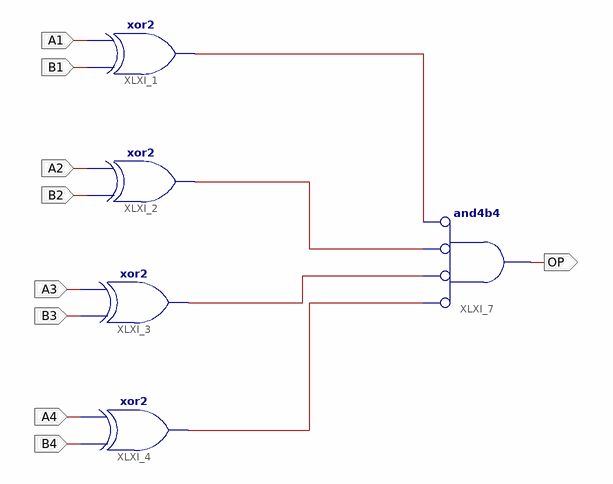
[diagram p0: schematic sheet 1]
// Xilinx ISE schematic Comparator.sch (spartan6) as structural Verilog: 5 symbols, 9 ports
module Comparator (
  input  A1,
  input  B1,
  input  A2,
  input  B2,
  input  A3,
  input  B3,
  input  A4,
  input  B4,
  output OP
);

  wire XLXN_9, XLXN_10, XLXN_11, XLXN_13;

  xor XLXI_1 (XLXN_9, B1, A1);
  xor XLXI_2 (XLXN_10, B2, A2);
  xor XLXI_3 (XLXN_11, B3, A3);
  xor XLXI_4 (XLXN_13, B4, A4);
  and XLXI_7 (OP, ~XLXN_13, ~XLXN_11, ~XLXN_10, ~XLXN_9);  // and4b4
endmodule
